# EAGLE schematic SparkFun RTK Facet - Cellular (EAGLE 9.6.2)

## Sheet 1 of 2
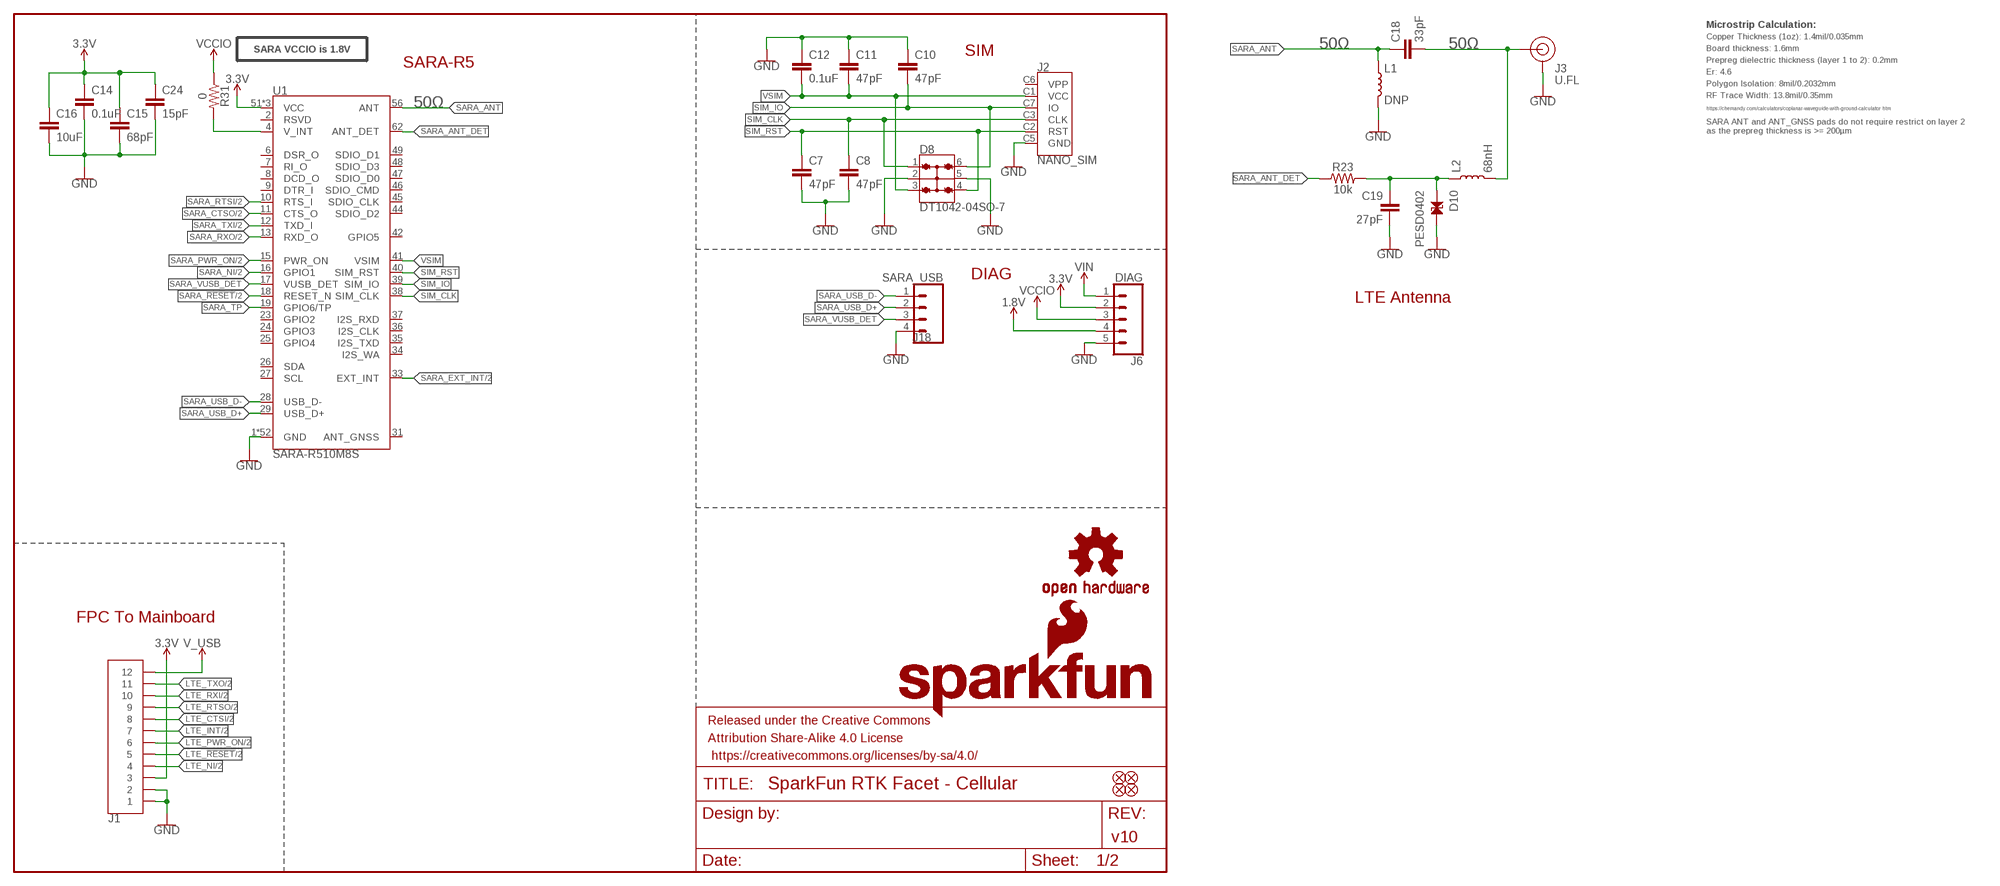
[diagram p0: schematic, sheet 1]

### Parts
C7  47pF  47PF-0603-50V-5%  [0603]
C8  47pF  47PF-0603-50V-5%  [0603]
C10  47pF  47PF-0603-50V-5%  [0603]
C11  47pF  47PF-0603-50V-5%  [0603]
C12  0.1uF  0.1UF-0603-25V-5%  [0603]
C14  0.1uF  0.1UF-0603-25V-5%  [0603]
C15  68pF  68PF-0603-50V-5%  [0603]
C16  10uF  10UF-0603-6.3V-20%  [0603]
C18  33pF  33PF-0402-25V-5%-X7R  [0402]
C19  27pF  27PF-0402-25V-5%-X7R  [0402]
C24  15pF  15PF-0603-50V-5%  [0603]
D8  DT1042-04SO-7  TVS_DIODE_ARRAY_4DT1042-04SO-7  [SOT23-6L]
D10  PESD0402  [0402]
FID1  FIDUCIAL1X2  [FIDUCIAL-1X2]
FID2  FIDUCIAL1X2  [FIDUCIAL-1X2]
FID3  FIDUCIAL1X2  [FIDUCIAL-1X2]
FID4  FIDUCIAL1X2  [FIDUCIAL-1X2]
FRAME1  FRAME-LETTER  [CREATIVE_COMMONS]
J1  FPC_12_0.5MM_BACKFLIP  [FPC_12_DOUBLESIDED_BACKFLIP]
J2  NANO_SIM  NANO_SIMWURTH  [NANO_SIM_WURTH_693043020611]
J3  U.FL  U.FL2PIN  [U.FL]
J6  DIAG  CONN_05NO_SILK  [1X05_NO_SILK]
J18  SARA_USB  CONN_041X04_NO_SILK  [1X04_NO_SILK]
L1  DNP  INDUCTOR_DNP-0402  [0402_COILCRAFT]
L2  68nH  68NH-0402  [0402_COILCRAFT]
LOGO3  OSHW-LOGOMINI  [OSHW-LOGO-MINI]
LOGO5  SFE_LOGO_NAME_FLAME.1_INCH  [SFE_LOGO_NAME_FLAME_.1]
R23  10k  10KOHM-0603-1/10W-1%  [0603]
R31  0  0OHM-0603-1/10W  [0603]
U1  SARA-R510M8S  [SARA-LGA]

### Nets
1.8V: J6.4
3.3V [power]: C14.1 C15.1 C16.1 C24.1 J1.3 J6.2 U1.51(VCC) U1.52(VCC) U1.53(VCC) ; also sheet 2
GND: C7.2 C8.2 C10.1 C11.1 C12.1 C14.2 C15.2 C16.2 C19.2 C24.2 D8.2 D8.5 D10.2 J1.1 J1.2 J2.C5(GND) J3.1(GND) J3.2(GND) J6.5 J18.4 L1.P$2 U1.1(GND) U1.3(GND) U1.5(GND) U1.14(GND) U1.20(GND) U1.21(GND) U1.22(GND) U1.30(GND) U1.32(GND) U1.43(GND) U1.50(GND) U1.54(GND) U1.55(GND) U1.57(GND) U1.58(GND) U1.59(GND) U1.60(GND) U1.61(GND) U1.63(GND) U1.64(GND) U1.65(GND) U1.66(GND) U1.67(GND) U1.68(GND) U1.69(GND) U1.70(GND) U1.71(GND) U1.72(GND) U1.73(GND) U1.74(GND) U1.75(GND) U1.76(GND) U1.77(GND) U1.78(GND) U1.79(GND) U1.80(GND) U1.81(GND) U1.82(GND) U1.83(GND) U1.84(GND) U1.85(GND) U1.86(GND) U1.87(GND) U1.88(GND) U1.89(GND) U1.90(GND) U1.91(GND) U1.92(GND) U1.93(GND) U1.94(GND) U1.95(GND) U1.96(GND) ; also sheet 2
LTE_!RESET!: J1.5 ; also sheet 2
LTE_CTSI: J1.8 ; also sheet 2
LTE_INT: J1.7 ; also sheet 2
LTE_NI: J1.4 ; also sheet 2
LTE_PWR_ON: J1.6 ; also sheet 2
LTE_RTSO: J1.9 ; also sheet 2
LTE_RXI: J1.10 ; also sheet 2
LTE_TXO: J1.11 ; also sheet 2
N$15: C18.2 J3.FEED(SIGNAL) L2.P$2
N$16: C19.1 D10.1 L2.P$1 R23.2
N$31: R31.2 U1.4(V_INT)
SARA_!RESET!: U1.18(RESET_N) ; also sheet 2
SARA_ANT: C18.1 L1.P$1 U1.56(ANT)
SARA_ANT_DET: R23.1 U1.62(ANT_DET)
SARA_CTSO: U1.11(CTS_O) ; also sheet 2
SARA_EXT_INT: U1.33(EXT_INT) ; also sheet 2
SARA_NI: U1.16(GPIO1) ; also sheet 2
SARA_PWR_ON: U1.15(PWR_ON) ; also sheet 2
SARA_RTSI: U1.10(RTS_I) ; also sheet 2
SARA_RXO: U1.13(RXD_O) ; also sheet 2
SARA_TP: U1.19(GPIO6/TP)
SARA_TXI: U1.12(TXD_I) ; also sheet 2
SARA_USB_D+: J18.2 U1.29(USB_D+)
SARA_USB_D-: J18.1 U1.28(USB_D-)
SARA_VUSB_DET: J18.3 U1.17(VUSB_DET)
SIM_CLK: C8.1 D8.1 J2.C3(CLK) U1.38(SIM_CLK)
SIM_IO: C10.2 D8.6 J2.C7(IO) U1.39(SIM_IO)
SIM_RST: C7.1 D8.4 J2.C2(RST) U1.40(SIM_RST)
V_USB: J1.12
VCCIO: J6.3 R31.1 ; also sheet 2
VIN: J6.1
VSIM: C11.2 C12.2 D8.3 J2.C1(VCC) U1.41(VSIM)
Unconnected: J2.C6(VPP) U1.2(RSVD) U1.6(DSR_O) U1.7(RI_O) U1.8(DCD_O) U1.9(DTR_I) U1.23(GPIO2) U1.24(GPIO3) U1.25(GPIO4) U1.26(SDA) U1.27(SCL) U1.31(ANT_GNSS) U1.34(I2S_WA) U1.35(I2S_TXD) U1.36(I2S_CLK) U1.37(I2S_RXD) U1.42(GPIO5) U1.44(SDIO_D2) U1.45(SDIO_CLK) U1.46(SDIO_CMD) U1.47(SDIO_D0) U1.48(SDIO_D3) U1.49(SDIO_D1)

### Notes on the sheet
- Microstrip Calculation:
- Copper Thickness (1oz): 1.4mil/0.035mm
- SARA VCCIO is 1.8V
- SIM | 50Ω | 50Ω
- Board thickness: 1.6mm
- SARA-R5 | Prepreg dielectric thickness (layer 1 to 2): 0.2mm
- Er: 4.6
- Polygon Isolation: 8mil/0.2032mm
- RF Trace Width: 13.8mil/0.35mm
- 50Ω
- https://chemandy.com/calculators/coplanar-waveguide-with-ground-calculator.htm
- SARA ANT and ANT_GNSS pads do not require restrict on layer 2
  as the prepreg thickness is >= 200µm
- DIAG
- LTE Antenna
- FPC To Mainboard
- v10

## Sheet 2 of 2
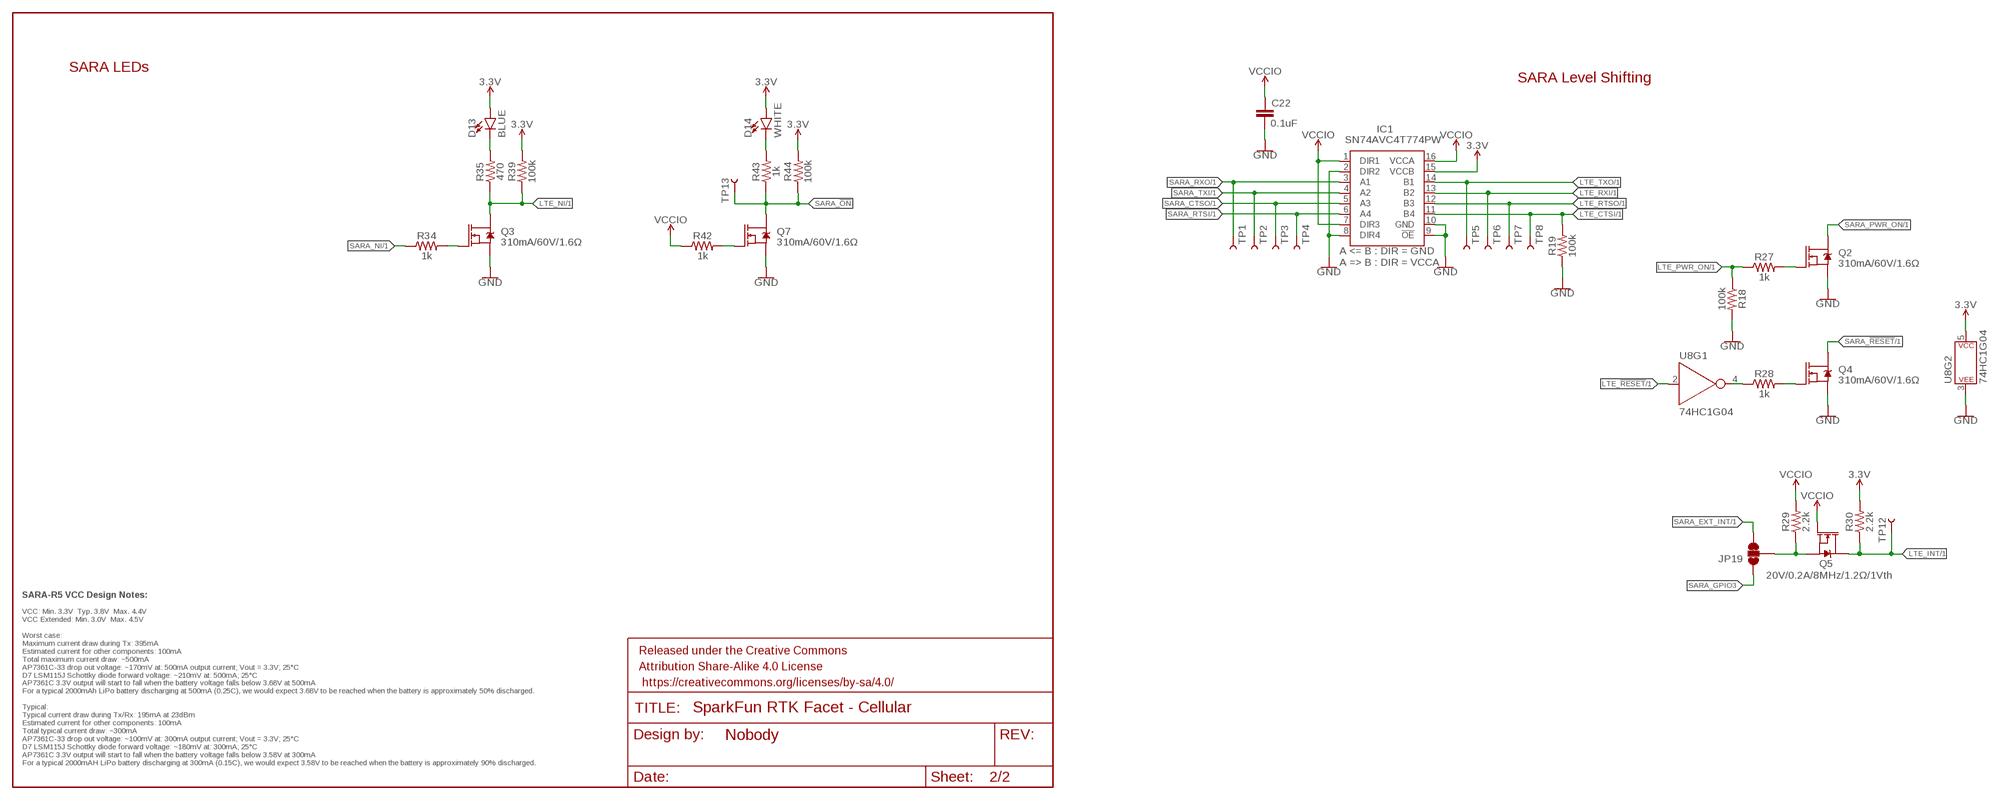
[diagram p1: schematic, sheet 2]

### Parts
C22  0.1uF  0.1UF-0603-25V-(+80/-20%)  [0603]
D13  BLUE  LED-BLUE0603  [LED-0603]
D14  WHITE  LED-WHITE0603  [LED-0603]
FRAME2  FRAME-LETTERNO_PACKAGE  [DUMMY]
IC1  SN74AVC4T774PW  [SOP65P640X120-16N]
JP19  JUMPER-SMT_3_1-NC_TRACE_SILK  [SMT-JUMPER_3_1-NC_TRACE_SILK]
Q2  310mA/60V/1.6Ω  MOSFET-NCH-2N7002PW  [SOT323]
Q3  310mA/60V/1.6Ω  MOSFET-NCH-2N7002PW  [SOT323]
Q4  310mA/60V/1.6Ω  MOSFET-NCH-2N7002PW  [SOT323]
Q5  20V/0.2A/8MHz/1.2Ω/1Vth  MOSFET-NCH-RE1C00UNTL  [SOT-416FL]
Q7  310mA/60V/1.6Ω  MOSFET-NCH-2N7002PW  [SOT323]
R18  100k  100KOHM-0603-1/10W-1%  [0603]
R19  100k  100KOHM-0603-1/10W-1%  [0603]
R27  1k  1KOHM-0603-1/10W-1%  [0603]
R28  1k  1KOHM-0603-1/10W-1%  [0603]
R29  2.2k  2.2KOHM-0603-1/10W-1%  [0603]
R30  2.2k  2.2KOHM-0603-1/10W-1%  [0603]
R34  1k  1KOHM-0603-1/10W-1%  [0603]
R35  470  470OHM-0603-1/10W-1%  [0603]
R39  100k  100KOHM-0603-1/10W-1%  [0603]
R42  1k  1KOHM-0603-1/10W-1%  [0603]
R43  1k  1KOHM-0603-1/10W-1%  [0603]
R44  100k  100KOHM-0603-1/10W-1%  [0603]
TP1  TEST-POINT3  [PAD.03X.03]
TP2  TEST-POINT3  [PAD.03X.03]
TP3  TEST-POINT3  [PAD.03X.03]
TP4  TEST-POINT3  [PAD.03X.03]
TP5  TEST-POINT3  [PAD.03X.03]
TP6  TEST-POINT3  [PAD.03X.03]
TP7  TEST-POINT3  [PAD.03X.03]
TP8  TEST-POINT3  [PAD.03X.03]
TP12  TEST-POINT3  [PAD.03X.03]
TP13  TEST-POINT3  [PAD.03X.03]
U8  74HC1G04  [SOT353]

### Nets
3.3V [power]: D13.A D14.A IC1.15(VCCB) R30.2 R39.2 R44.2 U8.5(P$V+) ; also sheet 1
GND: C22.2 IC1.2(DIR2) IC1.8(DIR4) IC1.9(!OE) IC1.10(GND) Q2.2(S) Q3.2(S) Q4.2(S) Q7.2(S) R18.2 R19.1 U8.3(P$V-) ; also sheet 1
LTE_!RESET!: U8.2(A) ; also sheet 1
LTE_CTSI: IC1.11(B4) R19.2 TP8.P$1 ; also sheet 1
LTE_INT: Q5.3(D) R30.1 TP12.P$1 ; also sheet 1
LTE_NI: Q3.3(D) R35.1 R39.1 ; also sheet 1
LTE_PWR_ON: R18.1 R27.1 ; also sheet 1
LTE_RTSO: IC1.12(B3) TP7.P$1 ; also sheet 1
LTE_RXI: IC1.13(B2) TP6.P$1 ; also sheet 1
LTE_TXO: IC1.14(B1) TP5.P$1 ; also sheet 1
N$26: Q2.1(G) R27.2
N$27: Q4.1(G) R28.2
N$28: R28.1 U8.4(Y)
N$35: Q3.1(G) R34.2
N$37: D13.C R35.2
N$43: JP19.2 Q5.2(S) R29.1
N$47: Q7.1(G) R42.2
N$49: D14.C R43.2
SARA_!ON!: Q7.3(D) R43.1 R44.1 TP13.P$1
SARA_!RESET!: Q4.3(D) ; also sheet 1
SARA_CTSO: IC1.5(A3) TP3.P$1 ; also sheet 1
SARA_EXT_INT: JP19.3 ; also sheet 1
SARA_GPIO3: JP19.1
SARA_NI: R34.1 ; also sheet 1
SARA_PWR_ON: Q2.3(D) ; also sheet 1
SARA_RTSI: IC1.6(A4) TP4.P$1 ; also sheet 1
SARA_RXO: IC1.3(A1) TP1.P$1 ; also sheet 1
SARA_TXI: IC1.4(A2) TP2.P$1 ; also sheet 1
VCCIO: C22.1 IC1.1(DIR1) IC1.7(DIR3) IC1.16(VCCA) Q5.1(G) R29.2 R42.1 ; also sheet 1

### Notes on the sheet
- SARA LEDs
- SARA Level Shifting
- SARA-R5 VCC Design Notes:
- VCC: Min. 3.3V  Typ. 3.8V  Max. 4.4V
  VCC Extended: Min. 3.0V  Max. 4.5V
  
  Worst case:
  Maximum current draw during Tx: 395mA
  Estimated current for other components: 100mA
  Total maximum current draw: ~500mA
  AP7361C-33 drop out voltage: ~170mV at: 500mA output current; Vout = 3.3V; 25°C
  D7 LSM115J Schottky diode forward voltage: ~210mV at: 500mA; 25°C
  AP7361C 3.3V output will start to fall when the battery voltage falls below 3.68V at 500mA
  For a typical 2000mAh LiPo battery discharging at 500mA (0.25C), we would expect 3.68V to be reached when the battery is approximately 50% discharged.
  
  Typical:
  Typical current draw during Tx/Rx: 195mA at 23dBm
  Estimated current for other components: 100mA
  Total typical current draw: ~300mA
  AP7361C-33 drop out voltage: ~100mV at: 300mA output current; Vout = 3.3V; 25°C
  D7 LSM115J Schottky diode forward voltage: ~180mV at: 300mA; 25°C
  AP7361C 3.3V output will start to fall when the battery voltage falls below 3.58V at 300mA
  For a typical 2000mAH LiPo battery discharging at 300mA (0.15C), we would expect 3.58V to be reached when the battery is approximately 90% discharged.

## Library data of the parts
C7 C8 C10 C11 = SparkFun-Capacitors:47PF: 47pF ceramic capacitors A capacitor is a passive two-terminal electrical component used to store electrical energy temporarily in an electric field.; PROD_ID: CAP-08913
C12 C14 = SparkFun-Capacitors:0.1UF: 0.1µF ceramic capacitors A capacitor is a passive two-terminal electrical component used to store electrical energy temporarily in an electric field.; PROD_ID: CAP-08604
C15 = SparkFun-Capacitors:68PF: 68pF ceramic capacitors A capacitor is a passive two-terminal electrical component used to store electrical energy temporarily in an electric field.; PROD_ID: CAP-14092
C16 = SparkFun-Capacitors:10UF: 10.0µF ceramic capacitors A capacitor is a passive two-terminal electrical component used to store electrical energy temporarily in an electric field.; PROD_ID: CAP-11015
C18 = New_Parts:33PF: 33pF ceramic capacitors A capacitor is a passive two-terminal electrical component used to store electrical energy temporarily in an electric field.; DIGIKEY_PART: 490-5936-1-ND; MANUFACTURER: Murata; MANU_PART: GRM1555C1H330JA; PROD_ID: CAP-15358
C19 = New_Parts:27PF: 27pF ceramic capacitors A capacitor is a passive two-terminal electrical component used to store electrical energy temporarily in an electric field.; DIGIKEY_PART: 490-11384-1-ND; MANUFACTURER: Murata; MANU_PART: GRM1555C1H270JA; PROD_ID: CAP-15357
C22 = SparkFun-Capacitors:0.1UF: 0.1µF ceramic capacitors A capacitor is a passive two-terminal electrical component used to store electrical energy temporarily in an electric field.; PROD_ID: CAP-00810
C24 = SparkFun-Capacitors:15PF: 15pF ceramic capacitors A capacitor is a passive two-terminal electrical component used to store electrical energy temporarily in an electric field.; PROD_ID: CAP-07881
D8 = ublox:TVS_DIODE_ARRAY_4; PROD_ID: DIO-14095
D10 = New_Parts:PESD0402: ESD protection diode PESD is used to protect a signal line from ESD.; DIGIKEY_PART: PESD0402-140CT-ND; MOUSE_PART: 650-PESD0402-140; PROD_ID: DIO-15359
D13 = SparkFun-LED:LED-BLUE: Blue SMD LED Used in manufacturing of various products at SparkFun Packages: 0603 - SMD 0603 package [Product Link] <http://www.digikey.com/product-detail/en/SMLE12BC7TT86/511-1589-2-ND/1641808> 1206 - SMD1206 package [Product Link] <http://www.digikey.com/product-detail/en/lite-on-inc/LTST-C150TBKT/160-1643-1-ND/573584> SparkFun Products: ESP8266 Thing-Dev Board <https://www.sparkfun.com/products/13711> RedBoard <https://www.sparkfun.com/products/12757>; PROD_ID: DIO-08575
D14 = SparkFun-LED:LED-WHITE: White SMD LED Used in manufacturing several products at SparkFun. Packages: 0603 - Bright White SMD 0603 package[Product Link] <http://www.kingbrightusa.com/product.asp?catalog_name=LED&product_id=APT1608QWF/D> 1206 - Bright White SMD1206 package [Product Link] <http://www.kingbrightusa.com/product.asp?catalog_name=LED&product_id=APT3216QWF/D> 3014 - Super Bright SMD 3014 package [Datasheet] <http://www.lumileds.com/uploads/459/DS208-pdf> SparkFun Products: Blackberry Trackballer Breakout <https://www.sparkfun.com/products/13169> Digital SandBox <https://www.sparkfun.com/products/12651>; PROD_ID: DIO-09004
FID1-FID4 = SparkFun-Aesthetics:FIDUCIAL: Fiducial Alignment Points Point-of-reference for pick-and-place machines and other optical instruments.
FRAME1 = SparkFun-Aesthetics:FRAME-LETTER: Schematic Frame - Letter Standard 8.5x11 US Letter frame
FRAME2 = SparkFun-Aesthetics:FRAME-LETTER: Schematic Frame - Letter Standard 8.5x11 US Letter frame; DESIGNER: Nobody; VERSION: v01
IC1 = New_Parts:SN74AVC4T774PW: Texas Instruments,SN74AVC4T774PW,IC, Texas Instruments SN74AVC4T774PW, Dual, Bus Transceiver, 4-Bit Non-Inverting 3-State, 1.2 3.6 V, 16-Pin TSSOP Source: Datasheet <http://www.ti.com/lit/ds/symlink/sn74avc4t774.pdf>; ARROW_PART_NUMBER: SN74AVC4T774PW; ARROW_PRICE-STOCK: https://www.arrow.com/en/products/sn74avc4t774pw/texas-instruments; DESCRIPTION: Texas Instruments,SN74AVC4T774PW,IC, Texas Instruments SN74AVC4T774PW, Dual, Bus Transceiver, 4-Bit Non-Inverting 3-State, 1.2 3.6 V, 16-Pin TSSOP; MANUFACTURER_NAME: Texas Instruments; MANUFACTURER_PART_NUMBER: SN74AVC4T774PW; MOUSER_PART_NUMBER: 595-SN74AVC4T774PW; MOUSER_PRICE-STOCK: https://www.mouser.co.uk/ProductDetail/Texas-Instruments/SN74AVC4T774PW?qs=WxL8HmPi5r44hV1AE7gRvg%3D%3D; PROD_ID: IC-15360
J1 = RTK Facet:FPC_12_0.5MM; PROD_ID: CONN-15766
J2 = ublox:NANO_SIM; PROD_ID: CONN-14097
J3 = SparkFun-Connectors:U.FL2PIN: SMD Antenna Connector - U.FL 2mm height, 3.0mm x 3.0mm receptacle size. SparkFun Products: SparkFun WiFi Shield - ESP8266 <https://www.sparkfun.com/products/13287> SparkFun ESP8266 Thing <https://www.sparkfun.com/products/13231> SparkFun MiniGen - Pro Mini Signal Generator Shield <https://www.sparkfun.com/products/11420>; PROD_ID: CONN-09193; SF_ID: WRL-09144
J6 = SparkFun-Connectors:CONN_05: Multi connection point. Often used as Generic Header-pin footprint for 0.1 inch spaced/style header connections On any of the 0.1 inch spaced packages, you can populate with these: Break Away Headers - Straight <https://www.sparkfun.com/products/116> (PRT-00116) Break Away Male Headers - Right Angle <https://www.sparkfun.com/products/553> (PRT-00553) Female Headers <https://www.sparkfun.com/products/115> (PRT-00115) Break Away Headers - Machine Pin <https://www.sparkfun.com/products/117> (PRT-00117) Break Away Female Headers - Swiss Machine Pin <https://www.sparkfun.com/products/743> (PRT-00743) For SCREWTERMINALS and SPRING TERMINALS visit here: Screw Terimnals on SparkFun.com <https://www.sparkfun.com/search/results?term=Screw+Terminals> (5mm/3.5mm/2.54mm spacing) This device is also useful as a general connection point to wire up your design to another part of your project. Our various solder wires solder well into these plated through hole pads. Hook-Up Wire - Assortment (Stranded, 22 AWG) <https://www.sparkfun.com/products/11375> (PRT-11375) Hook-Up Wire - Assortment (Solid Core, 22 AWG) <https://www.sparkfun.com/products/11367> (PRT-11367) View the entire wire category on our website here <https://www.sparkfun.com/categories/141> Special notes: Molex polarized connector foot print use with SKU : PRT-08231 with associated crimp pins and housings. 1MM SMD Version SKU: PRT-10208
J18 = SparkFun-Connectors:CONN_04: Multi connection point. Often used as Generic Header-pin footprint for 0.1 inch spaced/style header connections On any of the 0.1 inch spaced packages, you can populate with these: Break Away Headers - Straight <https://www.sparkfun.com/products/116> (PRT-00116) Break Away Male Headers - Right Angle <https://www.sparkfun.com/products/553> (PRT-00553) Female Headers <https://www.sparkfun.com/products/115> (PRT-00115) Break Away Headers - Machine Pin <https://www.sparkfun.com/products/117> (PRT-00117) Break Away Female Headers - Swiss Machine Pin <https://www.sparkfun.com/products/743> (PRT-00743) For SCREWTERMINALS and SPRING TERMINALS visit here: Screw Terimnals on SparkFun.com <https://www.sparkfun.com/search/results?term=Screw+Terminals> (5mm/3.5mm/2.54mm spacing) This device is also useful as a general connection point to wire up your design to another part of your project. Our various solder wires solder well into these plated through hole pads. Hook-Up Wire - Assortment (Stranded, 22 AWG) <https://www.sparkfun.com/products/11375> (PRT-11375) Hook-Up Wire - Assortment (Solid Core, 22 AWG) <https://www.sparkfun.com/products/11367> (PRT-11367) View the entire wire category on our website here <https://www.sparkfun.com/categories/141> Special notes: Molex polarized connector foot print use with SKU : PRT-08231 with associated crimp pins and housings. 1MM SMD Version SKU: PRT-10208; PROD_ID: CONN-09696
JP19 = SparkFun-Jumpers:JUMPER-SMT_3_1-NC_TRACE: Normally closed trace jumper (1 of 2 connections) This jumper has a trace between two pads so it's normally closed (NC). The other connection is normally open (NO). Use a razor knife to open the connection. For best results follow the IPC guidelines for cutting traces: Cutout at least 0.063 mm (0.005 in). Remove all loose material to clean up the cut area. Seal the cut with an approved epoxy. Reapply solder to reclose the connection, or to close the NO connection.
L1 = New_Parts:INDUCTOR_DNP
L2 = New_Parts:68NH; DIGIKEY_PART: 490-2633-1-ND; MOUSER_PART: 81-LQG15HS68NJ02D; PROD_ID: NDUC-15356
LOGO3 = SparkFun-Aesthetics:OSHW-LOGO: Open-Source Hardware (OSHW) Logo This logo indicates the piece of hardware it is found on incorporates a OSHW license and/or adheres to the definition of open source hardware found here: http://freedomdefined.org/OSHW
LOGO5 = SparkFun-Aesthetics:SFE_LOGO_NAME_FLAME: SparkFun Font Logo w/ Flame This is the SparkFun full logo. The logo on the schematic will always be the same size; the package variant is the height of the flame part of the logo. Default layer for the logo on the board is tSilk.
Q2-Q4 Q7 = SparkFun-DiscreteSemi:MOSFET-NCH: N-channel MOSFETs Voltage controlled devices that allow control of high current outputs. SparkFun Products: SparkFun OpenScale <https://www.sparkfun.com/products/13261> SparkFun Digital Sandbox <https://www.sparkfun.com/products/12651> SparkFun Monster Moto Shield <https://www.sparkfun.com/products/10182> SparkFun MOSFET Power Controller <https://www.sparkfun.com/products/11214>; PROD_ID: TRANS-11151
Q5 = SparkFun-DiscreteSemi:MOSFET-NCH: N-channel MOSFETs Voltage controlled devices that allow control of high current outputs. SparkFun Products: SparkFun OpenScale <https://www.sparkfun.com/products/13261> SparkFun Digital Sandbox <https://www.sparkfun.com/products/12651> SparkFun Monster Moto Shield <https://www.sparkfun.com/products/10182> SparkFun MOSFET Power Controller <https://www.sparkfun.com/products/11214>; PROD_ID: TRANS-14399
R18 R19 R39 R44 = SparkFun-Resistors:100KOHM: 100kΩ resistor A resistor is a passive two-terminal electrical component that implements electrical resistance as a circuit element. Resistors act to reduce current flow, and, at the same time, act to lower voltage levels within circuits. - Wikipedia; PROD_ID: RES-07828
R23 = SparkFun-Resistors:10KOHM: 10kΩ resistor A resistor is a passive two-terminal electrical component that implements electrical resistance as a circuit element. Resistors act to reduce current flow, and, at the same time, act to lower voltage levels within circuits. - Wikipedia; PROD_ID: RES-00824
R27 R28 R34 R42 R43 = SparkFun-Resistors:1KOHM: 1kΩ resistor A resistor is a passive two-terminal electrical component that implements electrical resistance as a circuit element. Resistors act to reduce current flow, and, at the same time, act to lower voltage levels within circuits. - Wikipedia; PROD_ID: RES-07856
R29 R30 = SparkFun-Resistors:2.2KOHM: 2.2kΩ resistor A resistor is a passive two-terminal electrical component that implements electrical resistance as a circuit element. Resistors act to reduce current flow, and, at the same time, act to lower voltage levels within circuits. - Wikipedia; PROD_ID: RES-08272
R31 = SparkFun-Resistors:0OHM: 0Ω resistor A resistor is a passive two-terminal electrical component that implements electrical resistance as a circuit element. Resistors act to reduce current flow, and, at the same time, act to lower voltage levels within circuits. - Wikipedia; PROD_ID: RES-08609
R35 = SparkFun-Resistors:470OHM: 470Ω resistor A resistor is a passive two-terminal electrical component that implements electrical resistance as a circuit element. Resistors act to reduce current flow, and, at the same time, act to lower voltage levels within circuits. - Wikipedia; PROD_ID: RES-07869
TP1-TP8 TP12 TP13 = SparkFun-Connectors:TEST-POINT: SparkFun Test Points Bare copper test points for troubleshooting or In-Circuit-Testing. These are used by our Production team for verifying production board runs using pogo-pins on test beds. SparkFun Products: SparkFun LSM9DS1 Breakout <https://www.sparkfun.com/products/13284> SparkFun PSOC <https://www.sparkfun.com/products/13714> SparkFun Load Cell Amplifier <https://www.sparkfun.com/products/13879>
U1 = SARA_R5:SARA-R510M8S; PROD_ID: IC-15573
U8 = SparkFun-IC-Logic:74*1G04: Single Inverter IC NOT GATE INVERTER SNGL 1IN SOT353 Supply: 1.65V to 5.5V Datasheet <http://diodes.com/datasheets/74LVC1G04.pdf> SparkFun Products SparkFun Stepoko <https://www.sparkfun.com/products/13899> (ROB-13899) SparkFun CryptoShield <https://www.sparkfun.com/products/13183> (DEV-13183) SparkFun LogicBlocks Kit <https://www.sparkfun.com/products/11006> (KIT-11006) SparkFun ArduMoto <https://www.sparkfun.com/products/9815> (DEV-09815); PROD_ID: COMP-08268

## Net classes
0 default: width 0 mm, drill 0 mm
1 power: width 0.178 mm